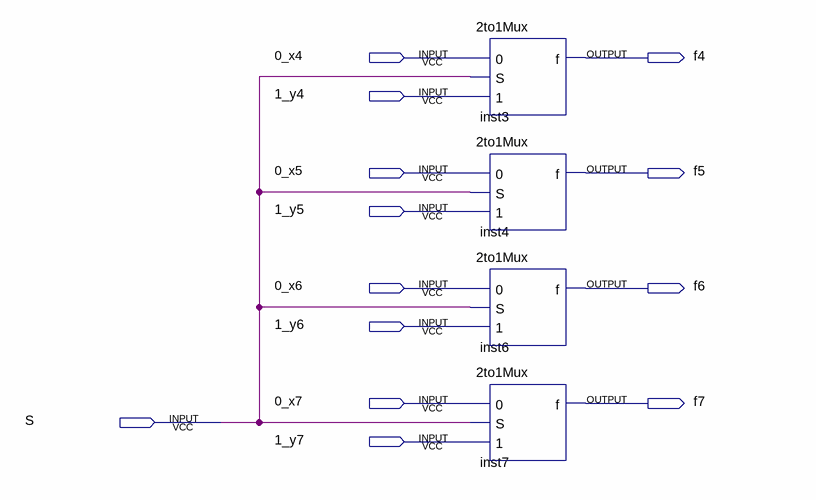
[diagram p0: schematic sheet]
// Quartus schematic 4Muxes.bdf as structural Verilog: 4 symbols, 13 pins
module \4Muxes  (
  input  \0_x4 ,
  input  \1_y4 ,
  input  \0_x5 ,
  input  \1_y5 ,
  input  \0_x6 ,
  input  \1_y6 ,
  input  \0_x7 ,
  input  S,
  input  \1_y7 ,
  output f4,
  output f5,
  output f6,
  output f7
);

  \2to1Mux  inst3 (.\0 (\0_x4 ), .S(S), .\1 (\1_y4 ), .f(f4));
  \2to1Mux  inst4 (.\0 (\0_x5 ), .S(S), .\1 (\1_y5 ), .f(f5));
  \2to1Mux  inst6 (.\0 (\0_x6 ), .S(S), .\1 (\1_y6 ), .f(f6));
  \2to1Mux  inst7 (.\0 (\0_x7 ), .S(S), .\1 (\1_y7 ), .f(f7));
endmodule
